# EAGLE design Mainboard (EAGLE 4.15)

## Sheet 1 of 2
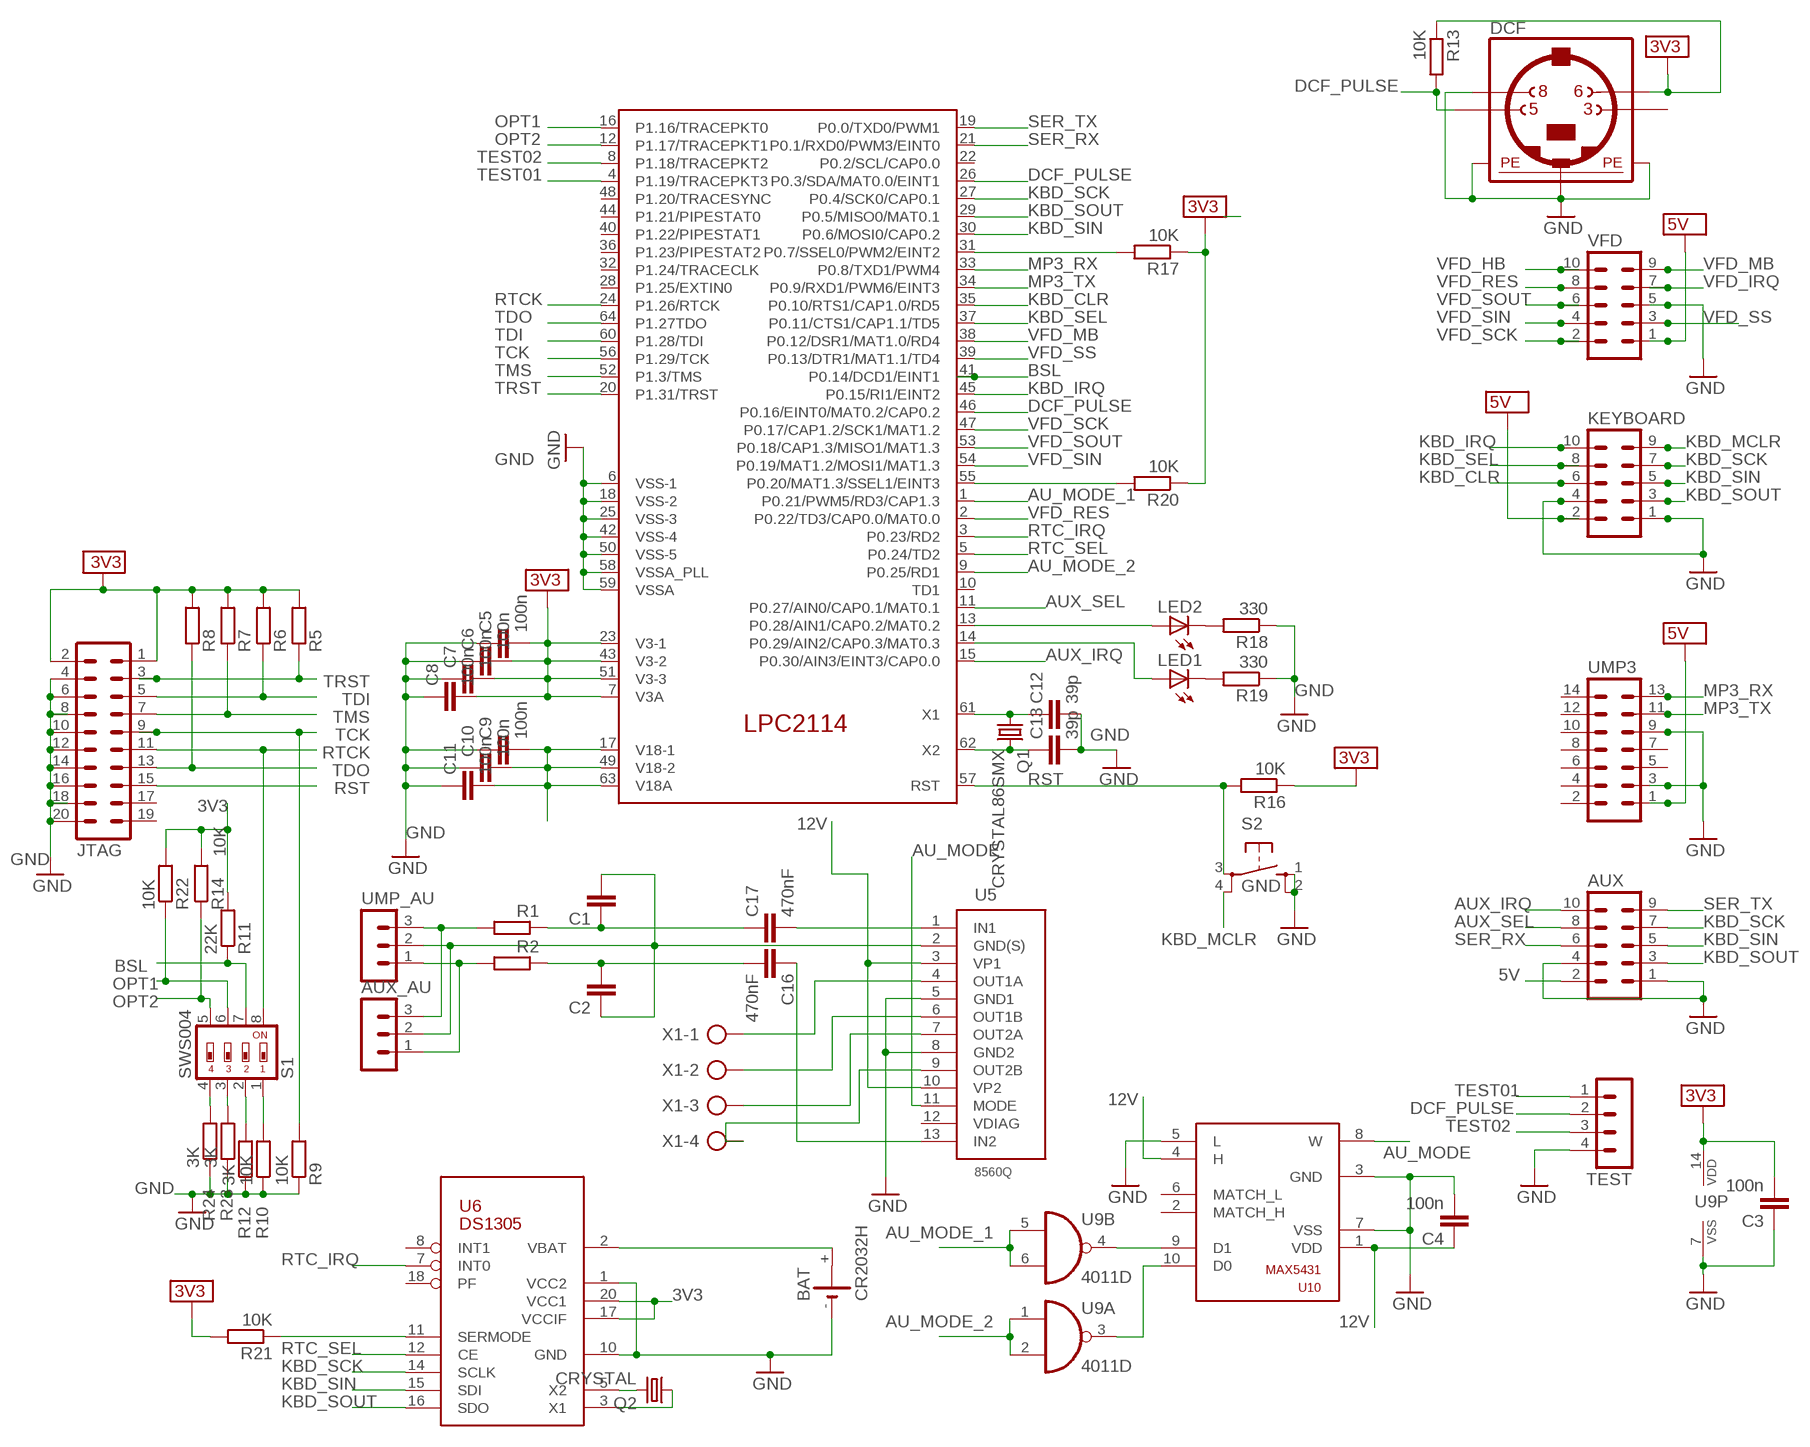
[diagram p0: schematic, sheet 1]

### Parts
AUX  ML10  [ML10]
AUX_AU  MA03-1  [MA03-1]
BAT  CR2032H  [CR2032H]
C1  C-EUC0805  [C0805]
C2  C-EUC0805  [C0805]
C3  100n  C-EUC0805  [C0805]
C4  100n  C-EUC0805  [C0805]
C5  100n  C-EUC0805  [C0805]
C6  100n  C-EUC0805  [C0805]
C7  100n  C-EUC0805  [C0805]
C8  100n  C-EUC0805  [C0805]
C9  100n  C-EUC0805  [C0805]
C10  100n  C-EUC0805  [C0805]
C11  100n  C-EUC0805  [C0805]
C12  39p  C-EUC0805  [C0805]
C13  39p  C-EUC0805  [C0805]
C16  470nF  C-EUC0805  [C0805]
C17  470nF  C-EUC0805  [C0805]
DCF  MINI_DIN_4  [M_DIN4]
JTAG  ML20L  [ML20L]
KEYBOARD  ML10  [ML10]
LED1  LEDCHIP-LED0805  [CHIP-LED0805]
LED2  LEDCHIP-LED0805  [CHIP-LED0805]
Q1  CRYSTAL86SMX  [86SMX]
Q2  CRYSTAL  CRYSTAL85SMX  [85SMX]
R1  R-EU_M0805  [M0805]
R2  R-EU_M0805  [M0805]
R5  R-EU_M0805  [M0805]
R6  R-EU_M0805  [M0805]
R7  R-EU_M0805  [M0805]
R8  R-EU_M0805  [M0805]
R9  10K  R-EU_M0805  [M0805]
R10  10K  R-EU_M0805  [M0805]
R11  22K  R-EU_M0805  [M0805]
R12  3K  R-EU_M0805  [M0805]
R13  10K  R-EU_M0805  [M0805]
R14  10K  R-EU_M0805  [M0805]
R16  10K  R-EU_M0805  [M0805]
R17  10K  R-EU_M0805  [M0805]
R18  330  R-EU_M0805  [M0805]
R19  330  R-EU_M0805  [M0805]
R20  10K  R-EU_M0805  [M0805]
R21  10K  R-EU_M0805  [M0805]
R22  10K  R-EU_M0805  [M0805]
R23  3K  R-EU_M0805  [M0805]
R24  3K  R-EU_M0805  [M0805]
S1  SWS004  [SMS-004]
S2  10XX  [B3F-10XX]
TEST  MA04-1  [MA04-1]
U1  LPC2114  [TQFP64-10X10]
U5  8560Q  [SOT141-6]
U6  DS1305  [TSSOP20]
U9  4011D  [SO14]
U10  MAX5431  [UMAX10]
UMP3  ML14  [ML14]
UMP_AU  MA03-1  [MA03-1]
VFD  ML10  [ML10]
X1  AK500/4  [AK500/4]

### Nets
1V8: C9.2 C10.2 C11.2 U1.17(V18-1) U1.49(V18-2) U1.63(V18A) ; also sheet 2
3V3: C3.2 C5.2 C6.2 C7.2 C8.2 DCF.6 JTAG.1 JTAG.2 R5.2 R6.2 R7.2 R8.2 R11.2 R13.1 R14.2 R16.1 R17.1 R20.1 R21.2 R22.2 U1.7(V3A) U1.23(V3-1) U1.43(V3-2) U1.51(V3-3) U6.17(VCCIF) U6.20(VCC1) U9.14(P:VDD) ; supply symbol labelled SUPPLY3V3 ; also sheet 2
5V [supply]: AUX.2 KEYBOARD.2 UMP3.1 VFD.1 ; supply symbol labelled SUPPLY5V ; also sheet 2
12V [highcurrent]: C4.1 U5.3(VP1) U5.10(VP2) U10.1(VDD) U10.4(H) ; also sheet 2
AU_MODE: U5.11(MODE) U10.8(W)
AU_MODE_1: U1.1(P0.21/PWM5/RD3/CAP1.3) U9.5(B:I0) U9.6(B:I1)
AU_MODE_2: U1.9(P0.25/RD1) U9.1(A:I0) U9.2(A:I1)
AUX_IRQ: AUX.10 U1.15(P0.30/AIN3/EINT3/CAP0.0)
AUX_SEL: AUX.8 U1.11(P0.27/AIN0/CAP0.1/MAT0.1)
BSL: R11.1 S1.7 U1.41(P0.14/DCD1/EINT1)
DCF_PULSE: DCF.5 R13.2 TEST.2 U1.26(P0.3/SDA/MAT0.0/EINT1) U1.46(P0.16/EINT0/MAT0.2/CAP0.2)
GND: AUX.1 AUX.4 BAT.- C3.1 C4.2 C5.1 C6.1 C7.1 C8.1 C9.1 C10.1 C11.1 C12.2 C13.2 DCF.8 DCF.SH1(PE1) DCF.SH2(PE2) DCF.SH3(PE3) JTAG.4 JTAG.6 JTAG.8 JTAG.10 JTAG.12 JTAG.14 JTAG.16 JTAG.18 JTAG.20 KEYBOARD.1 KEYBOARD.4 R9.1 R10.1 R12.1 R18.1 R19.1 R23.1 R24.1 S2.1 S2.2 TEST.4 U1.6(VSS-1) U1.18(VSS-2) U1.25(VSS-3) U1.42(VSS-4) U1.50(VSS-5) U1.58(VSSA_PLL) U1.59(VSSA) U5.5(GND1) U5.8(GND2) U6.1(VCC2) U6.10(GND) U9.7(P:VSS) U10.3(GND) U10.5(L) U10.7(VSS) UMP3.3 UMP3.9 VFD.5 ; also sheet 2
KBD_CLR: KEYBOARD.6 U1.35(P0.10/RTS1/CAP1.0/RD5)
KBD_IRQ: KEYBOARD.10 U1.45(P0.15/RI1/EINT2)
KBD_MCLR: KEYBOARD.9 S2.4
KBD_SCK: AUX.7 KEYBOARD.7 U1.27(P0.4/SCK0/CAP0.1) U6.14(SCLK)
KBD_SEL: KEYBOARD.8 U1.37(P0.11/CTS1/CAP1.1/TD5)
KBD_SIN: AUX.5 KEYBOARD.5 U1.30(P0.6/MOSI0/CAP0.2) U6.15(SDI)
KBD_SOUT: AUX.3 KEYBOARD.3 U1.29(P0.5/MISO0/MAT0.1) U6.16(SDO)
MP3_RX: U1.33(P0.8/TXD1/PWM4) UMP3.13
MP3_TX: U1.34(P0.9/RXD1/PWM6/EINT3) UMP3.11
N$1: AUX_AU.3 R1.2 UMP_AU.3
N$2: R10.2 S1.1
N$3: AUX_AU.1 R2.2 UMP_AU.1
N$4: LED1.C R19.2
N$5: R23.2 S1.3
N$6: LED2.C R18.2
N$7: LED2.A U1.13(P0.28/AIN1/CAP0.2/MAT0.2)
N$8: LED1.A U1.14(P0.29/AIN2/CAP0.3/MAT0.3)
N$9: R12.2 S1.2
N$10: C1.1 C17.1 R1.1
N$11: C2.2 C16.2 R2.1
N$12: AUX_AU.2 C1.2 C2.1 U5.2(GND(S)) UMP_AU.2
N$13: C17.2 U5.1(IN1)
N$14: C16.1 U5.13(IN2)
N$15 [highcurrent]: U5.4(OUT1A) X1.1
N$16 [highcurrent]: U5.6(OUT1B) X1.2
N$17 [highcurrent]: U5.7(OUT2A) X1.3
N$18 [highcurrent]: U5.9(OUT2B) X1.4
N$19: C12.1 Q1.1 U1.61(X1)
N$20: C13.1 Q1.4 U1.62(X2)
N$21: BAT.+ U6.2(VBAT)
N$22: Q2.4 U6.5(X2)
N$23: Q2.1 U6.3(X1)
N$24: U9.4(B:O) U10.9(D1)
N$25: U9.3(A:O) U10.10(D0)
N$26: R17.2 U1.31(P0.7/SSEL0/PWM2/EINT2)
N$27: R20.2 U1.55(P0.20/MAT1.3/SSEL1/EINT3)
N$28: R21.1 U6.11(SERMODE)
N$29: R24.2 S1.4
OPT1: R22.1 S1.6 U1.16(P1.16/TRACEPKT0)
OPT2: R14.1 S1.5 U1.12(P1.17/TRACEPKT1)
RST: JTAG.15 R16.2 S2.3 U1.57(RST)
RTC_IRQ: U1.3(P0.23/RD2) U6.7(INT0)
RTC_SEL: U1.5(P0.24/TD2) U6.12(CE)
RTCK: JTAG.11 S1.8 U1.24(P1.26/RTCK)
SER_RX: AUX.6 U1.21(P0.1/RXD0/PWM3/EINT0)
SER_TX: AUX.9 U1.19(P0.0/TXD0/PWM1)
TCK: JTAG.9 R9.2 U1.56(P1.29/TCK)
TDI: JTAG.5 R6.1 U1.60(P1.28/TDI)
TDO: JTAG.13 R8.1 U1.64(P1.27TDO)
TEST01: TEST.1 U1.4(P1.19/TRACEPKT3)
TEST02: TEST.3 U1.8(P1.18/TRACEPKT2)
TMS: JTAG.7 R7.1 U1.52(P1.3/TMS)
TRST: JTAG.3 R5.1 U1.20(P1.31/TRST)
VFD_HB: VFD.10
VFD_IRQ: VFD.7
VFD_MB: U1.38(P0.12/DSR1/MAT1.0/RD4) VFD.9
VFD_RES: U1.2(P0.22/TD3/CAP0.0/MAT0.0) VFD.8
VFD_SCK: U1.47(P0.17/CAP1.2/SCK1/MAT1.2) VFD.2
VFD_SIN: U1.54(P0.19/MAT1.2/MOSI1/MAT1.3) VFD.4
VFD_SOUT: U1.53(P0.18/CAP1.3/MISO1/MAT1.3) VFD.6
VFD_SS: U1.39(P0.13/DTR1/MAT1.1/TD4) VFD.3
Unconnected: BAT.+@1(+) DCF.3 JTAG.17 JTAG.19 U1.10(TD1) U1.22(P0.2/SCL/CAP0.0) U1.28(P1.25/EXTIN0) U1.32(P1.24/TRACECLK) U1.36(P1.23/PIPESTAT2) U1.40(P1.22/PIPESTAT1) U1.44(P1.21/PIPESTAT0) U1.48(P1.20/TRACESYNC) U5.12(VDIAG) U6.8(INT1) U6.18(PF) U9.8(C:I0) U9.9(C:I1) U9.10(C:O) U9.11(D:O) U9.12(D:I0) U9.13(D:I1) U10.2(MATCH_H) U10.6(MATCH_L) UMP3.2 UMP3.4 UMP3.5 UMP3.6 UMP3.7 UMP3.8 UMP3.10 UMP3.12 UMP3.14

## Sheet 2 of 2
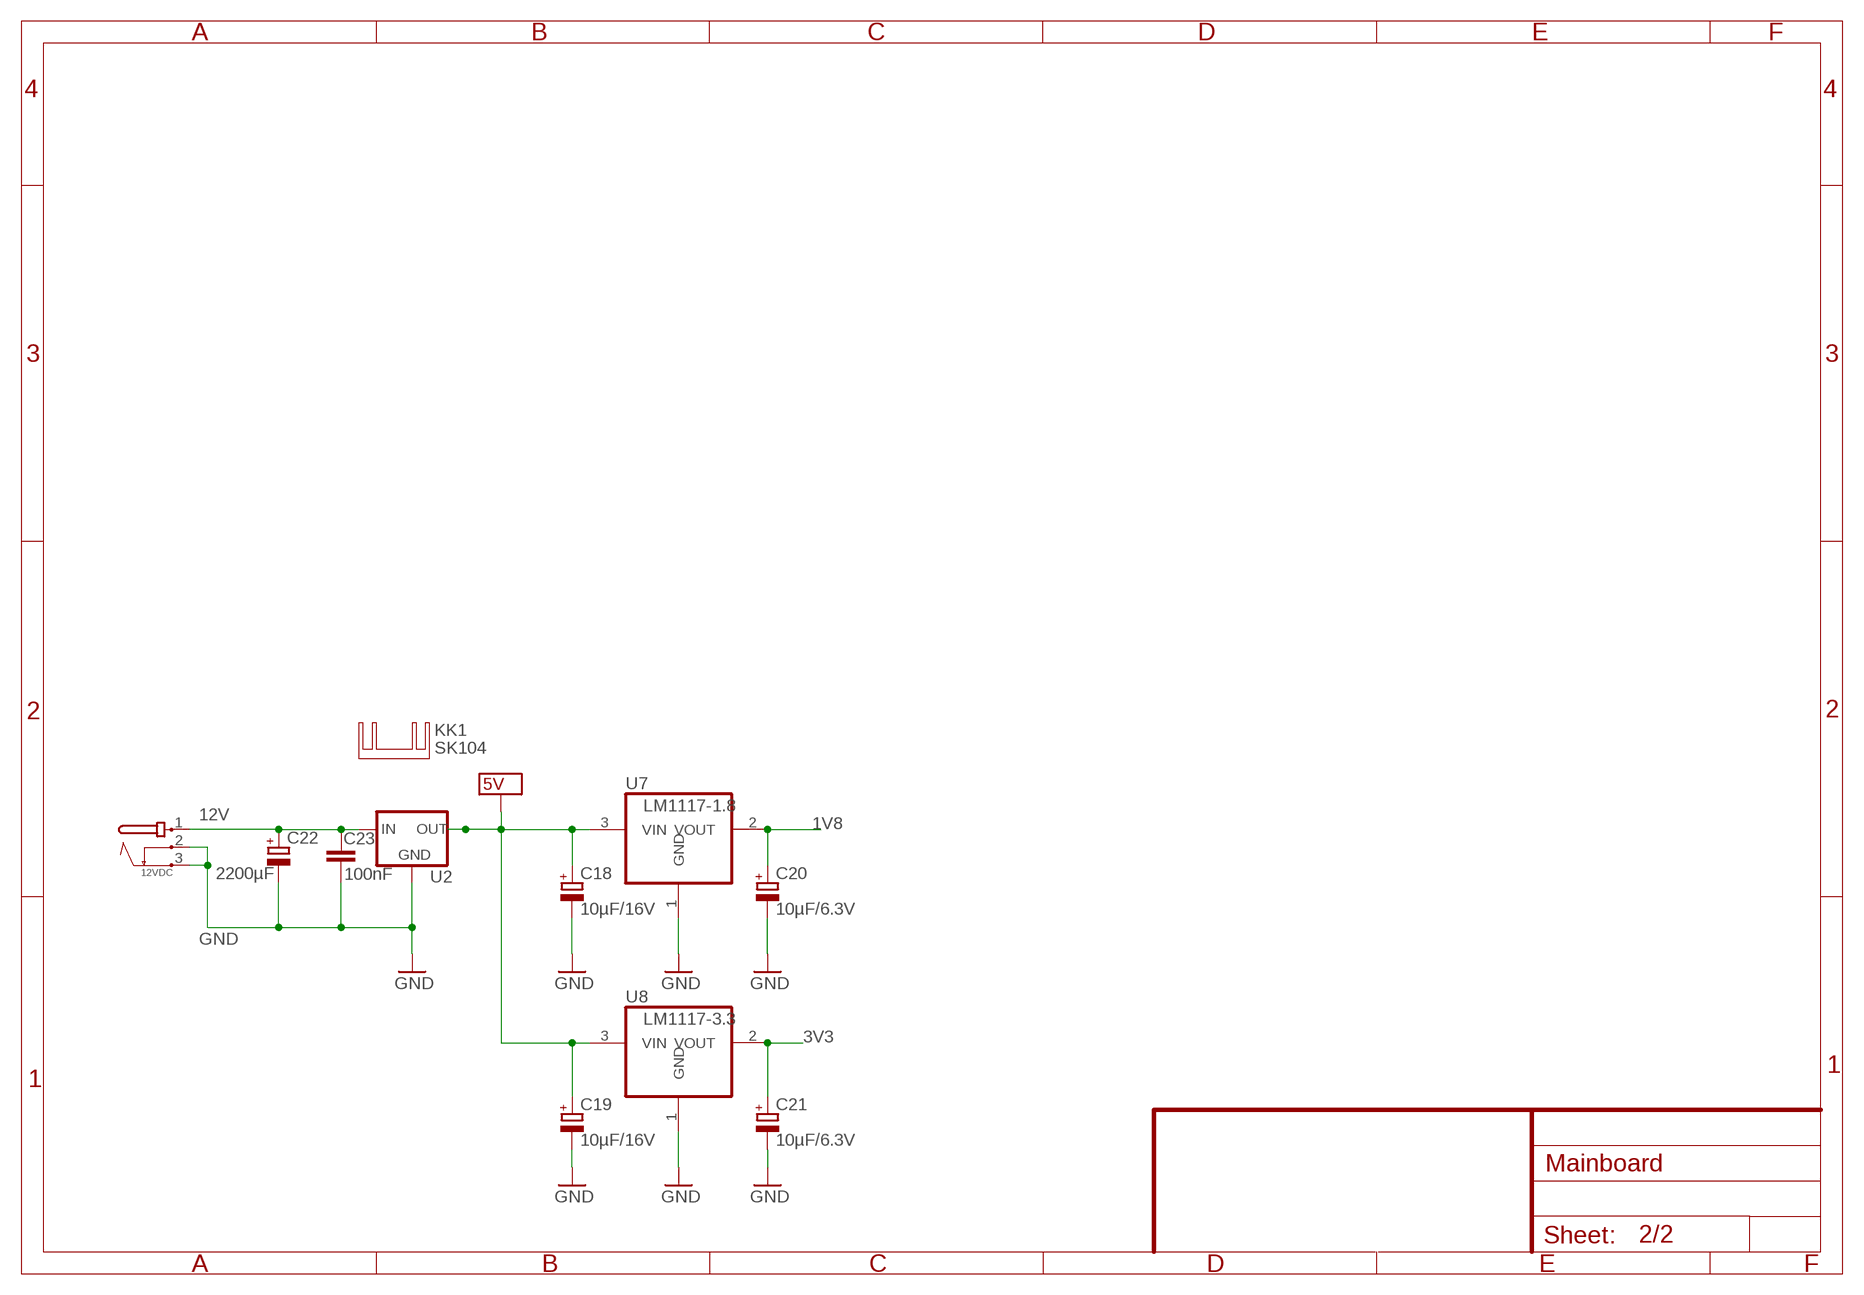
[diagram p1: schematic, sheet 2]

### Parts
12VDC  JACK-PMS  [JACK-PMS]
C18  10µF/16V  CPOL-EU153CLV-0405  [153CLV-0405]
C19  10µF/16V  CPOL-EU153CLV-0405  [153CLV-0405]
C20  10µF/6.3V  CPOL-EU153CLV-0405  [153CLV-0405]
C21  10µF/6.3V  CPOL-EU153CLV-0405  [153CLV-0405]
C22  2200µF  C-BIG  [PANASONIC_G]
C23  100nF  C-EUC0805K  [C0805K]
KK1  SK104  [SK104]
U2  78XXS  [78XXS]
U7  LM1117-1.8  REG1117  [SOT223]
U8  LM1117-3.3  REG1117  [SOT223]

### Nets
1V8: C20.+ U7.2(VOUT) ; also sheet 1
3V3: C21.+ U8.2(VOUT) ; also sheet 1
5V [supply]: C18.+ C19.+ U2.OUT U7.3(VIN) U8.3(VIN) ; supply symbol labelled SUPPLY5V ; also sheet 1
12V [highcurrent]: 12VDC.1 C22.+ C23.2 U2.IN ; also sheet 1
GND: 12VDC.2 12VDC.3 C18.- C19.- C20.- C21.- C22.- C23.1 U2.GND U7.1(GND) U8.1(GND) ; also sheet 1

## Library data of the parts
12VDC = POWER-IN:JACK-PMS
AUX KEYBOARD VFD = con-harting-ml:ML10: HARTING
AUX_AU UMP_AU = con-lstb:MA03-1: PIN HEADER
BAT = battery:CR2032H: LI BATTERY Varta
C1-C13 C16 C17 C23 = rcl:C-EU: CAPACITOR, European symbol
C18-C21 = rcl:CPOL-EU: POLARIZED CAPACITOR, European symbol
C22 = turbod3:C-BIG
DCF = mini_din:MINI_DIN_4
JTAG = con-harting-ml:ML20: HARTING
KK1 = heatsink:SK104: HEATSINK manufacturer Fischer/distributor Buerklin
LED1 LED2 = led:LED: LED OSRAM: - CHIPLED LG R971, LG N971, LY N971, LG Q971, LY Q971, LO R971, LY R971 LH N974, LH R974 LS Q976, LO Q976, LY Q976 LO Q996 - Hyper CHIPLED LW Q18S LB Q993, LB Q99A, LB R99A - SideLED LS A670, LO A670, LY A670, LG A670, LP A670 LB A673, LV A673, LT A673, LW A673 LH A674 LY A675 LS A676, LA A676, LO A676, LY A676, LW A676 LS A679, LY A679, LG A679 - Hyper Micro SIDELED® LS Y876, LA Y876, LO Y876, LY Y876 LT Y87S - SmartLED LW L88C, LW L88S LB L89C, LB L89S, LG L890 LS L89K, LO L89K, LY L89K LS L896, LA L896, LO L896, LY L896 - TOPLED LS T670, LO T670, LY T670, LG T670, LP T670 LSG T670, LSP T670, LSY T670, LOP T670, LYG T670 LG T671, LOG T671, LSG T671 LB T673, LV T673, LT T673, LW T673 LH T674 LS T676, LA T676, LO T676, LY T676, LB T676, LH T676, LSB T676, LW T676 LB T67C, LV T67C, LT T67C, LS T67K, LO T67K, LY T67K, LW E67C LS E67B, LA E67B, LO E67B, LY E67B, LB E67C, LV E67C, LT E67C LW T67C LS T679, LY T679, LG T679 LS T770, LO T770, LY T770, LG T770, LP T770 LB T773, LV T773, LT T773, LW T773 LH T774 LS E675, LA E675, LY E675, LS T675 LS T776, LA T776, LO T776, LY T776, LB T776 LHGB T686 LT T68C, LB T68C - Hyper Mini TOPLED® LB M676 - Mini TOPLED Santana® LG M470 LS M47K, LO M47K, LY M47K Source: http://www.osram.convergy.de/
Q1 Q2 = turbod3:CRYSTAL
R1 R2 R5-R14 R16-R24 = rcl:R-EU_: RESISTOR, European symbol
S1 = smd-special:SWS004: SMD Dip Switch 4 pol.
S2 = KEY_B:10XX
TEST = con-lstb:MA04-1: PIN HEADER
U1 = philips-2:LPC2114
U2 = v-reg:78XXS: VOLTAGE REGULATOR
U5 = tda8560q:8560Q: 2x40W Stereo BTL Amplifier
U6 = turbod3:DS1305
U7 U8 = burr-brown:REG1117: 800mA and 1A Low Dropout (LDO) Positive Regulator 1.8V, 2.5V, 2.85V, 3.3V, 5V, and Adj
U9 = 40xx:4011: Quad 2-input NAND
U10 = turbod3:MAX5431
UMP3 = con-harting-ml:ML14: HARTING
X1 = con-ptr500:AK500/4: CONNECTOR

## Net classes
1 supply: width 0.7 mm
2 highcurrent: width 2 mm

## Board
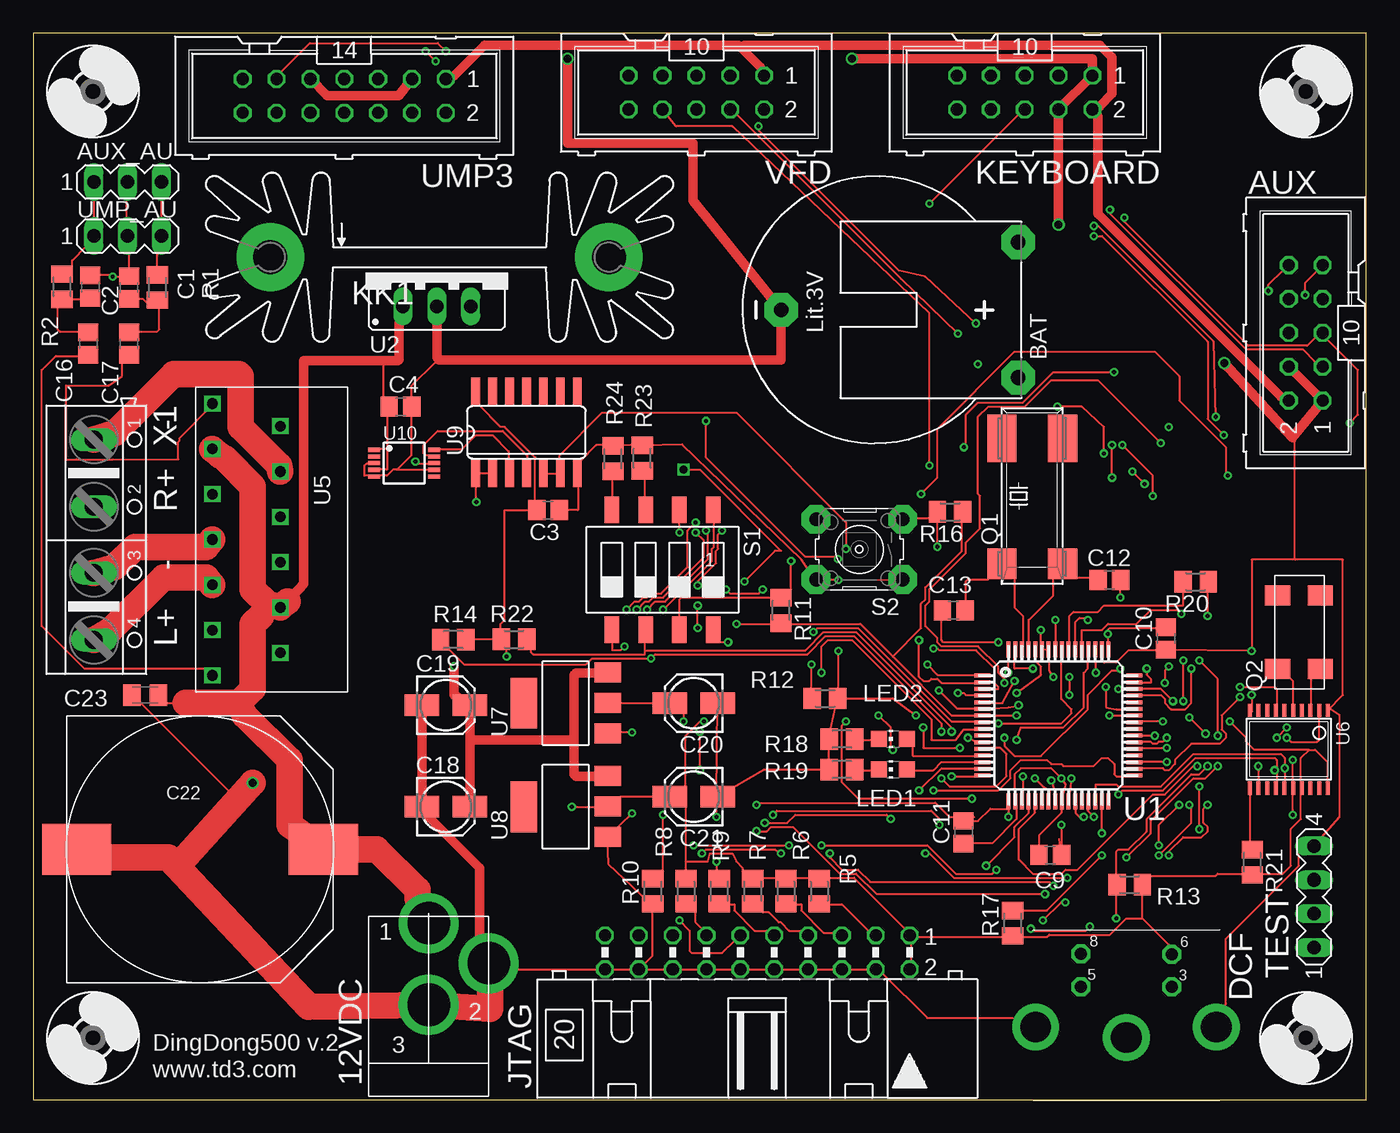
[diagram p2: board, top side]
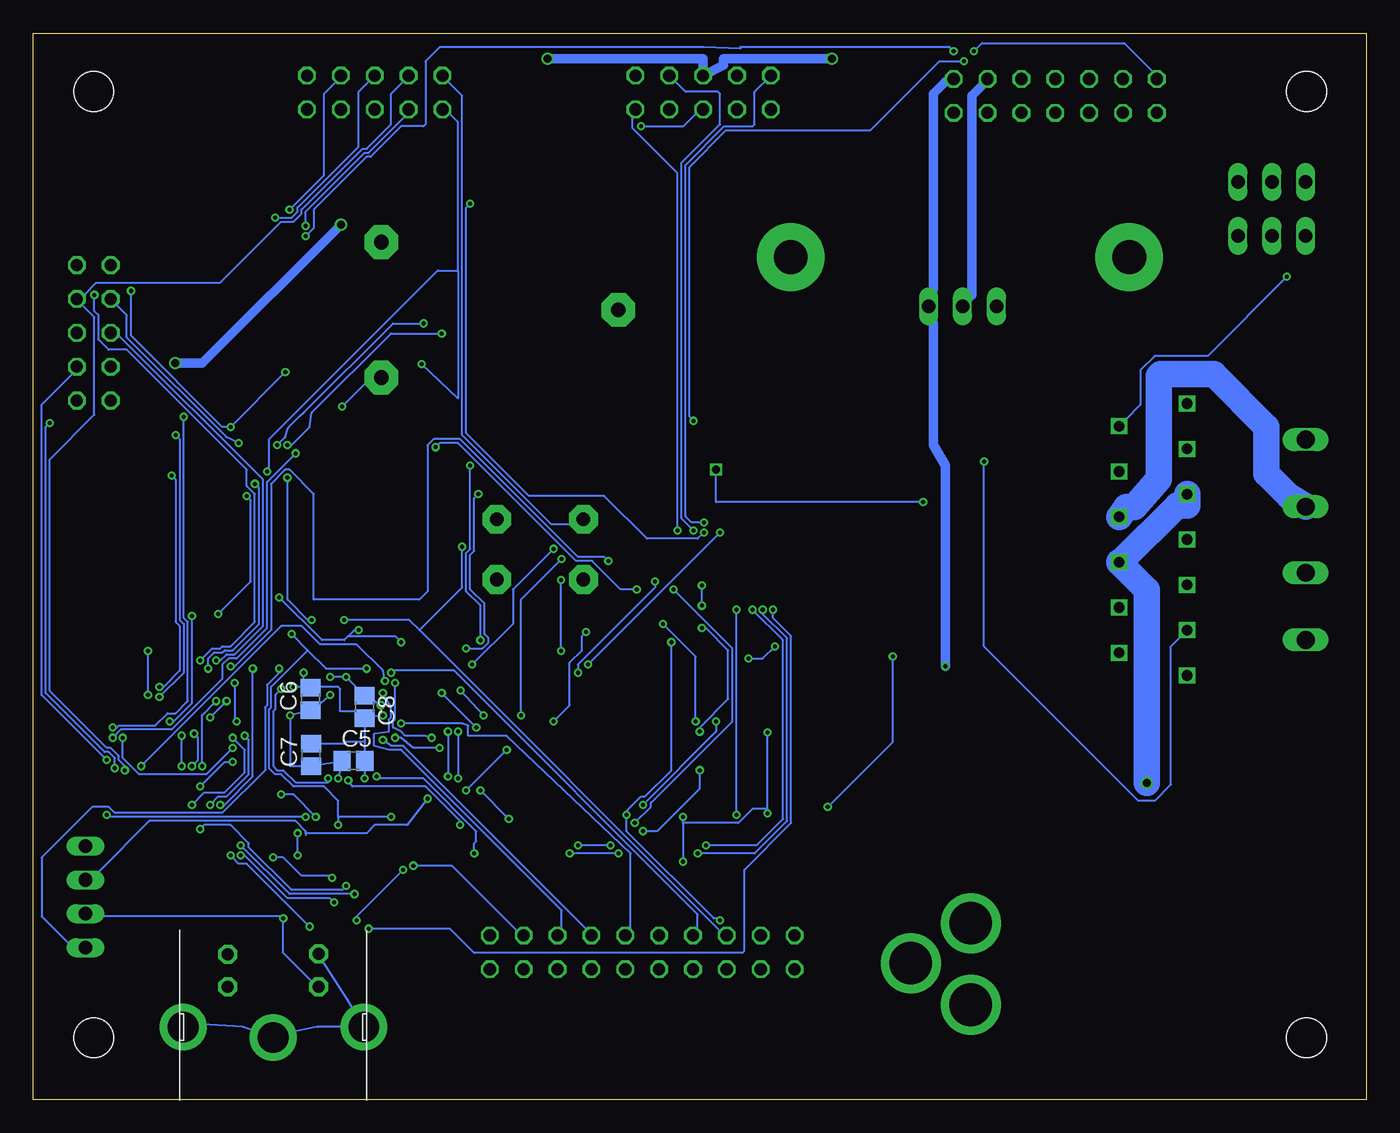
[diagram p3: board, bottom side, seen from below]

Size 100 x 80 mm. Coordinates in mm from the lower left corner, seen from the top.
Outline: 0,0 100,0 100,80 0,80 0,0
Copper layers (1*16): Top 0.035mm / dielectric 1.5mm / Bottom 0.035mm
Design rules "PCB-POOL": minimum track width 6mil, minimum drill 12mil, track to track 6mil, track to pad 6mil, pad to pad 6mil, via to via 6mil, smd to smd 6mil, copper to edge 20mil, drill to drill 8mil, minimum pad ring 8mil, minimum via ring 6mil, stop-mask expansion 3mil, vias tented up to drill 0mil, thermal gap 8mil

### Footprints (pad centres in the part's own frame; a part is rotated, then mirrored left to right if it is on the bottom)
JACK-PMS = drill 3.2 pad 4.5 round: 1 -0.5,-3.31; 2 -5,-0.31; 3 -0.5,2.809
ML10 = drill 0.914 octagon: 1 -5.08,-1.27; 2 -5.08,1.27; 3 -2.54,-1.27; 4 -2.54,1.27; 5 0,-1.27; 6 0,1.27; 7 2.54,-1.27; 8 2.54,1.27; 9 5.08,-1.27; 10 5.08,1.27
MA03-1 = drill 1.016 long: 1 -2.54,0; 2 0,0; 3 2.54,0
CR2032H = drill 1.118 pad 2.54 octagon: + 5.08,10.795; +@1 -5.08,10.795; - 0,-6.985
C0805 = smd 1.3 x 1.5: 1 -0.85,0; 2 0.85,0
153CLV-0405 = smd 2.6 x 1.6: + 1.8,0; - -1.8,0
PANASONIC_G = smd 5.2 x 3.8: + 9.25,0; - -9.25,0
C0805K = smd 1.3 x 1.6: 1 -1,0; 2 1,0
M_DIN4 = drill 0.9 pad 1.422 octagon: 3 -3.4,-3.75; 5 3.4,-3.75; 6 -3.4,-6.2; 8 3.4,-6.25 | drill 2.3 pad 3.5 round: SH1 6.8,-0.75; SH2 0,0.05; SH3 -6.75,-0.75
ML20L = drill 0.914 octagon: 1 -11.43,-1.27; 2 -11.43,1.27; 3 -8.89,-1.27; 4 -8.89,1.27; 5 -6.35,-1.27; 6 -6.35,1.27; 7 -3.81,-1.27; 8 -3.81,1.27; 9 -1.27,-1.27; 10 -1.27,1.27; 11 1.27,-1.27; 12 1.27,1.27; 13 3.81,-1.27; 14 3.81,1.27; 15 6.35,-1.27; 16 6.35,1.27; 17 8.89,-1.27; 18 8.89,1.27; 19 11.43,-1.27; 20 11.43,1.27
SK104 = drill 2.54 pad 5.08 round: A2,5 -12.7,-0.762; B2,5 12.7,-0.762
CHIP-LED0805 = smd 1.2 x 1.2: A 0,-1.05; C 0,1.05
86SMX = smd 2.286 x 2.184: 1 -5.08,-2.286; 4 -5.08,2.286 | smd 3.556 x 2.184: 2 4.318,-2.286; 3 4.318,2.286
85SMX = smd 1.5 x 1.9: 1 -2.6,-1.6; 2 2.9,-1.6; 3 2.9,1.6; 4 -2.6,1.6
M0805 = smd 1.3 x 1.6: 1 -0.95,0; 2 0.95,0
SMS-004 = smd 1.092 x 2.007: 1 -3.81,-4.496; 2 -1.27,-4.496; 3 1.27,-4.496; 4 3.81,-4.496; 5 3.81,4.496; 6 1.27,4.496; 7 -1.27,4.496; 8 -3.81,4.496
B3F-10XX = drill 1.016 pad 2.159 octagon: 1 -3.379,2.312; 2 3.123,2.312; 3 -3.379,-2.209; 4 3.123,-2.209
MA04-1 = drill 1.016 long: 1 -3.81,0; 2 -1.27,0; 3 1.27,0; 4 3.81,0
TQFP64-10X10 = smd 1.2 x 0.3: 1 -5.7,3.75; 2 -5.7,3.25; 3 -5.7,2.75; 4 -5.7,2.25; 5 -5.7,1.75; 6 -5.7,1.25; 7 -5.7,0.75; 8 -5.7,0.25; 9 -5.7,-0.25; 10 -5.7,-0.75; 11 -5.7,-1.25; 12 -5.7,-1.75; 13 -5.7,-2.25; 14 -5.7,-2.75; 15 -5.7,-3.25; 16 -5.7,-3.75; 33 5.7,-3.75; 34 5.7,-3.25; 35 5.7,-2.75; 36 5.7,-2.25; 37 5.7,-1.75; 38 5.7,-1.25; 39 5.7,-0.75; 40 5.7,-0.25; 41 5.7,0.25; 42 5.7,0.75; 43 5.7,1.25; 44 5.7,1.75; 45 5.7,2.25; 46 5.7,2.75; 47 5.7,3.25; 48 5.7,3.75 | smd 0.3 x 1.2: 17 -3.75,-5.7; 18 -3.25,-5.7; 19 -2.75,-5.7; 20 -2.25,-5.7; 21 -1.75,-5.7; 22 -1.25,-5.7; 23 -0.75,-5.7; 24 -0.25,-5.7; 25 0.25,-5.7; 26 0.75,-5.7; 27 1.25,-5.7; 28 1.75,-5.7; 29 2.25,-5.7; 30 2.75,-5.7; 31 3.25,-5.7; 32 3.75,-5.7; 49 3.75,5.7; 50 3.25,5.7; 51 2.75,5.7; 52 2.25,5.7; 53 1.75,5.7; 54 1.25,5.7; 55 0.75,5.7; 56 0.25,5.7; 57 -0.25,5.7; 58 -0.75,5.7; 59 -1.25,5.7; 60 -1.75,5.7; 61 -2.25,5.7; 62 -2.75,5.7; 63 -3.25,5.7; 64 -3.75,5.7
78XXS = drill 1.016 long: GND 0,-2.54; IN -2.54,-2.54; OUT 2.54,-2.54
SOT141-6 = drill 0.8 square: 1 -10.2,-3.81; 2 -8.5,1.29; 3 -6.8,-3.81; 4 -5.1,1.29; 5 -3.4,-3.81; 6 -1.7,1.29; 7 0,-3.81; 8 1.7,1.29; 9 3.4,-3.81; 10 5.1,1.29; 11 6.8,-3.81; 12 8.5,1.29; 13 10.2,-3.81
TSSOP20 = smd 0.305 x 0.991: 1 -2.925,-2.918; 2 -2.275,-2.918; 3 -1.625,-2.918; 4 -0.975,-2.918; 5 -0.325,-2.918; 6 0.325,-2.918; 7 0.975,-2.918; 8 1.625,-2.918; 9 2.275,-2.918; 10 2.925,-2.918; 11 2.925,2.918; 12 2.275,2.918; 13 1.625,2.918; 14 0.975,2.918; 15 0.325,2.918; 16 -0.325,2.918; 17 -0.975,2.918; 18 -1.625,2.918; 19 -2.275,2.918; 20 -2.925,2.918
SOT223 = smd 1.499 x 2.007: 1 -2.261,-3.15; 2 0.025,-3.15; 3 2.311,-3.15 | smd 3.81 x 2.007: 4 0,3.15
SO14 = smd 0.66 x 2.032: 1 -3.81,-3.073; 2 -2.54,-3.073; 3 -1.27,-3.073; 4 0,-3.073; 5 1.27,-3.073; 6 2.54,-3.073; 7 3.81,-3.073; 8 3.81,3.073; 9 2.54,3.073; 10 1.27,3.073; 11 0,3.073; 12 -1.27,3.073; 13 -2.54,3.073; 14 -3.81,3.073
UMAX10 = smd 0.32 x 0.9: 1 -1,-2.25; 2 -0.5,-2.25; 3 0,-2.25; 4 0.5,-2.25; 5 1,-2.25; 6 1,2.25; 7 0.5,2.25; 8 0,2.25; 9 -0.5,2.25; 10 -1,2.25
3,0 = hole 3: 0,0
ML14 = drill 0.914 octagon: 1 -7.62,-1.27; 2 -7.62,1.27; 3 -5.08,-1.27; 4 -5.08,1.27; 5 -2.54,-1.27; 6 -2.54,1.27; 7 0,-1.27; 8 0,1.27; 9 2.54,-1.27; 10 2.54,1.27; 11 5.08,-1.27; 12 5.08,1.27; 13 7.62,-1.27; 14 7.62,1.27
AK500/4 = drill 1.321 long: 1 -7.518,0; 2 -2.489,0; 3 2.489,0; 4 7.518,0

### Placement (x,y rotation side)
12VDC  29.17,9.92 180 top
AUX  95.47,57.53 90 top
AUX_AU  7.07,68.85 0 top
BAT  63.1,59.25 270 top
C1  7.18,60.93 90 top
C2  4.28,60.98 270 top
C3  38.62,44.22 180 top
C4  27.55,51.99 0 top
C5  75.98,25.42 0 bottom
C6  79.19,30.05 90 bottom
C7  79.16,25.85 90 bottom
C8  75.15,29.46 270 bottom
C9  76.29,18.35 0 top
C10  84.98,34.59 90 top
C11  69.79,20.06 90 top
C12  80.73,38.98 0 top
C13  69.05,36.7 180 top
C16  4.13,56.71 90 top
C17  7.18,56.71 270 top
C18  30.95,21.97 0 top
C19  30.95,29.59 0 top
C20  49.54,29.74 180 top
C21  49.54,22.73 180 top
C22  12.51,18.77 0 top
C23  8.39,30.35 0 top
DCF  82,4.69 180 top
JTAG  54.32,11.04 180 top
KEYBOARD  74.38,75.56 180 top
KK1  30.48,63.97 0 top
LED1  64.48,24.76 90 top
LED2  64.48,27.05 90 top
Q1  74.94,45.28 90 top
Q2  94.96,34.92 90 top
R1  9.31,60.93 90 top
R2  2.15,60.98 90 top
R5  58.97,15.63 90 top
R6  56.47,15.63 90 top
R7  53.97,15.63 90 top
R8  48.97,15.63 90 top
R9  51.47,15.63 270 top
R10  46.47,15.63 90 top
R11  56.1,36.7 270 top
R12  59.4,30.09 180 top
R13  82.26,16.12 180 top
R14  31.51,34.51 0 top
R16  68.78,44.09 180 top
R17  73.47,13.23 90 top
R18  60.67,27.05 0 top
R19  60.67,24.76 0 top
R20  87.2,38.84 180 top
R21  91.46,17.81 270 top
R22  36.07,34.53 180 top
R23  45.68,48.13 270 top
R24  43.49,48.09 270 top
S1  47.21,39.75 180 top
S2  61.85,41.33 180 top
TEST  96.09,15.21 90 top
U1  76.92,28.06 0 top
U2  30.28,62.05 0 top
U5  17.25,42.02 270 top
U6  94.2,26.28 180 top
U7  39.94,29.74 90 top
U8  39.94,21.97 90 top
U9  37,50.06 0 top
U10  27.82,47.75 270 top
U$2  [3,0]  4.47,75.63 0 top
U$4  [3,0]  95.47,75.63 0 top
U$7  [3,0]  95.47,4.63 0 top
U$13  [3,0]  4.47,4.63 0 top
UMP3  23.33,75.31 180 top
UMP_AU  7.07,64.79 0 top
VFD  49.75,75.56 180 top
X1  4.53,42 270 top

### Tracks (layer width: path | path; a pad name or v marks a point on that pad's centre or on a via)
1V8  (via drill 0.3)
  Top 0.152: v74.99,32.33 73.62,32.33 73.62,33.24 U1.63 | U1.49 80.63,34.31 v80.63,34.92 80.48,35.07 80.78,35.38 84.29,35.38 C10.2 | U7.2 44.06,29.74 C20.+ 48.78,28.98 v48.78,28.37 | 76.97,19.53 C9.2 77.13,19.07 v77.13,20.59 | v54.27,22.12 54.42,22.27 67.68,22.27 68.75,21.2 70.57,21.2 C11.2 70.42,20.9 70.88,20.9 71.79,21.81 73.16,21.81 | 73.16,21.81 v73.16,21.2 | 73.16,21.81 U1.17
  Bottom 0.152: v74.99,32.33 78.04,32.33 79.41,33.7 | 79.41,33.7 v80.63,34.92 | v48.78,28.37 48.78,27.61 v54.27,22.12 | 79.41,33.7 82.16,30.96 82.16,29.43 82.31,29.28 82.31,24.86 81.85,24.4 81.39,24.4 80.48,23.49 78.19,23.49 77.13,22.42 77.13,21.2 | 77.13,21.2 v77.13,20.59 | v73.16,21.2 77.13,21.2
3V3  (via drill 0.3)
  Top 0.152: v75.15,24.1 75.76,23.49 76.21,23.18 76.21,22.88 U1.23 | v80.48,30.96 80.48,29.43 81.24,29.28 82.16,29.28 U1.43 | v79.72,32.02 79.72,33.24 U1.51 | v73.77,28.82 71.79,28.82 U1.7 70.73,28.82 68.9,28.82 64.48,33.24 | 64.48,33.24 62.04,35.68 56.86,35.68 R11.2 55.33,35.68 v52.74,35.68 | 64.48,33.24 66.61,35.38 66.61,37.21 66.92,37.51 66.92,38.43 69.66,41.17 69.66,43.3 R16.1 | 83.22,13.58 83.22,15.41 R13.1 83.83,16.78 88.71,16.78 88.86,16.94 90.69,16.94 R21.2 92.22,16.94 93.74,16.94 94.35,17.55 94.35,20.29 95.11,21.05 95.11,22.88 U6.17 95.11,23.79 95.11,25.62 95.72,26.23 | 83.22,13.58 85.2,11.6 DCF.6 | 95.72,26.23 96.18,26.23 97.09,25.32 97.09,23.79 U6.20 | v88.1,36.29 88.1,38.12 R20.1 | v89.78,28.37 91,27.15 91,26.84 91.61,26.23 95.72,26.23 | JTAG.1 66.31,12.21 72.71,12.21 R17.1 74.23,12.21 76.06,12.21 76.21,12.37 80.78,12.37 82,13.58 83.22,13.58 | JTAG.2 65.85,10.38 65.85,11.76 JTAG.1 | JTAG.1 65.39,12.82 61.58,16.63 59.75,16.63 R5.2 58.23,16.63 57.16,16.63 R6.2 55.79,16.63 54.72,16.63 R7.2 53.2,17.09 53.2,17.39 52.74,17.85 52.44,18.46 50.76,18.46 50.61,17.85 48.93,17.85 | R22.2 34.81,34.53 32.98,34.53 R14.2 32.47,33.85 | C21.+ 44.06,22.73 U8.2 42.23,21.97 v40.4,21.97 | 48.93,17.85 48.93,21.97 C21.+ | 48.93,17.85 48.93,17.09 R8.2 | v35.52,33.24 35.52,35.07 R22.2 | v50.3,28.37 50,28.37 48.93,27.3 48.93,23.49 C21.+ | 37.66,44.22 35.37,44.22 35.37,35.99 35.06,35.68 35.06,35.23 R22.2 | U9.14 33.39,52.14 35.06,50.47 35.37,50.47 37.66,48.18 37.66,44.22 | 37.66,44.22 C3.2
  Bottom 0.152: 75.15,26.84 76.52,26.84 76.67,26.69 78.5,26.69 C7.2 | 75.15,26.84 75.15,26.08 C5.2 75.15,24.71 v75.15,24.1 | v80.48,30.96 79.87,30.96 C6.2 | v79.72,32.02 79.72,31.41 C6.2 | C6.2 78.5,30.96 77.13,30.96 76.97,30.8 76.97,29.13 75.91,29.13 C8.2 | C8.2 75.15,26.84 | v88.1,36.29 88.1,29.74 89.47,28.37 v89.78,28.37 | v35.52,33.24 35.52,26.84 v40.4,21.97 | v52.74,35.68 50.3,33.24 v50.3,28.37 | C8.2 74.99,28.67 v73.77,28.82
5V  (via drill 0.3)
  Top 0.7: AUX.2 93.59,52.75 79.87,66.47 79.87,73.78 KEYBOARD.2 80.02,74.54 80.94,75.46 80.94,78.2 80.02,79.12 53.35,79.12 53.12,78.89 | 40.55,26.99 40.55,31.87 40.7,32.02 42.23,32.02 U7.3 | 40.55,26.99 40.55,24.4 40.7,24.25 42.23,24.25 U8.3 | 32.78,26.99 32.78,28.82 C19.+ 31.56,30.35 v31.56,32.51 | 32.78,26.99 32.78,22.73 C18.+ | 32.78,26.99 40.55,26.99 | 53.12,78.89 54.57,77.44 VFD.1 | 53.12,78.89 52.9,79.12 33.85,79.12 31.56,76.83 UMP3.1
  Bottom 0.7: UMP3.1 31.56,76.37 32.47,75.46 32.47,60.83 U2.OUT 32.47,58.24 32.47,49.09 31.55,47.57 31.55,42.7 31.56,42.69 v31.56,32.51
12V
  Top 0.152: 9.4,30.4 9.37,30.43 | C23.2 9.4,30.4 | 11.44,29.74 10.06,29.74 9.4,30.4 | 26.23,55.43 26.23,52.6 C4.1 26.53,51.99 26.53,48.79 | U10.4 26.53,47.25 26.53,48.79 | U10.1 25.62,48.75 25.62,48.79 26.53,48.79
  Top 0.7: 19.06,37.36 20.27,38.67 20.27,55.43 26.23,55.43 27.37,55.43 27.37,55.53 27.45,55.53 27.45,58.24 U2.IN
  Top 2: 12VDC.1 28.82,15.11 28.82,15.72 25.77,18.77 C22.+ 19.21,20.59 19.21,25.47 15.86,28.82 15.41,29.74 | 19.06,37.36 U5.10 17.54,37.21 | 17.54,37.21 16.47,38.27 16.47,45.99 14.39,48.08 14.03,48.33 U5.3 | 11.44,29.74 15.41,29.74 | 15.41,29.74 16.47,30.8 16.47,35.68 17.08,36.29 17.54,37.21
AU_MODE  (via drill 0.3)
  Top 0.152: v28.66,47.87 28.82,47.72 29.73,47.72 U10.8
  Bottom 0.152: v28.66,47.87 28.66,34.01 17.08,22.42 15.86,22.42 14.64,23.64 14.64,34.01 14.03,34.62 U5.11
AU_MODE_1  (via drill 0.3)
  Top 0.152: v67.07,32.63 67.83,31.87 70.73,31.87 U1.1 | v60.97,41.32 60.97,43.3 52.74,51.53 42.69,51.53 39.48,48.33 39.48,47.87 U9.6 39.33,46.96 38.57,46.96 U9.5
  Bottom 0.152: v67.07,32.63 64.02,35.68 64.02,38.27 v60.97,41.32
AU_MODE_2  (via drill 0.3, 0.6)
  Top 0.152: U9.1 33.39,46.96 34.15,46.96 U9.2 33.24,46.99 v33.24,44.83 | v48.78,47.26 50,47.26 56.1,41.17 55.64,41.17 v53.35,38.88 | v59.14,32.02 59.14,34.01 59.6,34.46 61.43,34.46 67.37,28.52 67.37,26.99 69.2,26.99 69.81,27.76 71.18,27.76 U1.9
  Bottom 0.152: v33.24,44.83 48.78,44.83 v48.78,47.26 | v53.35,38.88 53.35,38.43 59.14,32.63 v59.14,32.02
AUX_IRQ  (via drill 0.3)
  Top 0.152: v66.46,23.18 68.14,24.86 70.73,24.86 U1.15 | v64.33,21.05 64.02,21.36 57.16,21.36 56.55,20.75 v54.88,20.75 | v51.98,38.27 52.29,37.97 54.42,37.97 v54.72,38.27 | v92.67,60.68 92.67,61.13 93.74,62.2 AUX.10 | v81.09,54.58 76.52,54.58 74.23,52.29 70.88,52.29 69.96,51.38 69.96,49.09 v69.81,48.94
  Bottom 0.152: v64.33,21.05 v66.46,23.18 | v54.88,20.75 53.66,21.97 53.66,22.27 47.56,28.37 47.56,33.85 v51.98,38.27 | v54.72,38.27 55.94,38.27 58.08,40.41 59.3,40.41 68.14,49.25 69.51,49.25 v69.81,48.94 | v92.67,60.68 92.67,57.32 85.81,50.47 v85.2,50.47 v81.09,54.58
AUX_SEL  (via drill 0.3)
  Top 0.152: v70.12,27.15 70.73,26.84 U1.11 | v72.86,31.26 72.86,31.57 72.4,32.02 72.4,32.48 70.88,34.01 68.14,34.01 67.83,34.31 67.83,34.62 66.92,35.53 66.92,37.05 67.22,37.36 67.22,38.27 69.96,41.02 69.96,41.78 71.03,42.85 71.03,45.28 70.88,45.44 70.88,51.23 71.64,51.99 74.38,51.99 76.36,53.97 79.87,53.97 v84.59,49.25
  Bottom 0.152: v70.12,27.15 70.57,27.3 72.1,27.3 72.4,27.61 73.01,27.91 73.01,28.37 72.86,28.52 v72.86,31.26 | v84.59,49.25 85.51,49.7 92.98,57.17 92.98,58.85 AUX.8
BSL  (via drill 0.3)
  Top 0.152: S1.7 48.48,37.51 48.63,37.66 55.33,37.66 R11.1 56.86,38.27 v56.86,40.41 | v84.75,28.37 83.22,28.37 U1.41 | v84.9,31.26 84.9,32.18 v85.2,32.48
  Bottom 0.152: v84.75,28.37 84.9,28.52 v84.9,31.26 | v85.2,32.48 84.9,32.48 82.16,35.23 82.16,46.2 81.09,47.26 80.78,47.26 78.96,45.44 78.96,37.51 71.03,37.51 70.42,38.12 70.42,49.09 69.96,49.55 67.98,49.55 59.14,40.71 57.16,40.71 v56.86,40.41
DCF_PULSE  (via drill 0.3)
  Top 0.152: v77.89,24.1 77.74,22.88 U1.26 | v81.39,30.8 82.16,30.8 U1.46 83.22,30.8 84.59,30.8 v85.51,29.89 | v81.24,13.58 81.24,15.41 R13.2 81.24,16.78 81.24,18.61 81.39,18.77 82.16,18.77 83.53,20.14 83.53,21.05 86.88,24.4 87.49,24.4 v88.1,25.01 | v87.95,27.45 v86.73,28.67
  Bottom 0.152: v77.89,24.1 77.74,23.95 77.89,23.79 80.33,23.79 81.24,24.71 81.7,24.71 82,25.01 82,29.13 81.85,29.28 81.85,30.35 v81.39,30.8 | DCF.5 79.11,8.86 81.24,10.99 v81.24,13.58 81.39,13.74 94.81,13.74 TEST.2 | v86.73,28.67 v85.51,29.89 | v87.95,27.45 87.64,27.15 87.64,25.47 v88.1,25.01
GND  (via drill 0.3, 0.3 pad 0.61, 0.6)
  Top 0.152: S2.2 58.64,38.98 57.62,40.51 48.68,49.14 R23.1 45.43,49.14 R24.1 42.84,49.09 42.23,49.09 41.01,47.87 U9.7 40.86,46.05 40.86,44.22 C3.1 | S2.1 65.49,38.98 S2.2 | v60.41,38.98 S2.2 | R12.1 60.41,30.35 v60.41,33.65 | R12.1 59.65,27.05 R18.1 59.65,24.76 | 51.27,22.73 C21.- 54.83,24.76 59.65,24.76 | 51.27,22.73 C20.- | 59.91,24.76 R19.1 59.65,24.76 | R12.1 64.48,30.09 v66.2,28.82 | v67.93,30.7 69.3,29.33 71.08,29.33 U1.6 73.16,29.43 v73.93,29.59 | U1.42 82.77,28.82 v80.73,28.82 | U6.10 91.4,29.08 v91.4,30.35 | 94.65,40.51 98.26,40.51 98.26,30.35 U6.1 97.24,29.33 98.01,28.82 98.01,21.2 TEST.4 94.96,18.46 94.96,17.55 89.47,12.06 89.47,7.18 DCF.SH3 | 94.65,40.51 91.4,40.51 v91.4,33.65 91.15,33.65 C10.1 84.29,33.7 82.16,33.7 81.24,32.79 80.33,32.79 80.17,32.94 80.17,33.24 U1.50 | 12VDC.2 35.17,9.93 35.33,9.77 JTAG.20 JTAG.18 | JTAG.18 JTAG.16 JTAG.14 JTAG.12 JTAG.10 JTAG.8 JTAG.6 JTAG.4 63.72,9.47 67.07,6.12 73.47,6.12 DCF.SH1 | JTAG.18 46.44,10.79 46.44,14.6 R10.1 46.7,14.35 43.14,17.65 U8.1 v44.92,21.46 | U7.1 43.14,27.55 v44.92,27.55 | v51.27,21.2 51.27,22.73 | R9.1 51.27,16.63 v51.27,17.85 | v76.52,31.72 76.21,32.18 76.21,33.7 | 76.21,33.7 U1.58 | 76.21,33.7 U1.59 75.67,33.78 75.6,33.85 v75.6,35.23 | v77.74,31.72 v77.74,30.35 | C11.1 70.42,19.22 71.95,19.22 73.77,21.05 73.77,21.81 U1.18 73.62,22.88 73.62,24.4 74.08,24.86 76.36,24.86 v77.13,24.1 77.43,23.64 77.13,22.42 U1.25 77.13,21.81 77.13,21.51 75.45,19.83 75.45,19.07 C9.1 | 94.65,40.51 94.65,49.4 94.45,49.65 | 15.32,22.48 15.37,22.43 | 15.32,22.48 | C23.1 7.45,30.35 15.32,22.48 | v16.47,23.74 16.56,23.74 16.57,23.73 15.32,22.48
  Top 0.152: 30.44,55.49 30.19,55.34 28.36,53.51 28.36,52.6 C4.2 28.36,51.38 28.36,48.33 27.29,47.26 | U10.3 25.16,47.72 25.01,47.72 24.85,47.57 24.85,46.81 25.16,46.81 U10.5 25.92,46.81 26.53,46.81 26.99,47.26 27.29,47.26 | 27.29,47.26 29.73,47.26 U10.7 | v72.4,34.31 68.29,34.31 68.14,34.46 68.14,35.99 C13.2 | v81.55,37.66 81.55,38.27 C12.2
  Top 0.7: 12VDC.2 33.49,9.93 33.49,17.39 28.92,21.97 C18.- 29.15,29.82 | 29.15,29.82 C19.- | 29.15,29.82 29.17,29.84 | v40.09,78.1 40.09,71.75 49.49,71.75 49.49,67.43 BAT.- 56.1,59.56 56.1,55.49 30.44,55.49 30.28,55.66 U2.GND 30.19,59.56 | v61.43,78.1 79.46,78.1 KEYBOARD.1 KEYBOARD.4 | KEYBOARD.4 76.67,74.04 | UMP3.9 22.06,75.31 27.39,75.31 UMP3.3 | AUX.4 AUX.1 94.45,49.65 v89.37,55.24 | v76.92,65.65 KEYBOARD.4 | R24.1 43.4,49.04 43.4,49.14 R24.1
  Top 2: 10.76,17.48 10.12,18.16 3.26,18.16 C22.- | 10.76,17.48 20.64,6.96 12VDC.3 34.25,6.81 34.25,9.93 | 34.25,9.93 34.25,10.03 | 34.25,9.93 12VDC.2 | 10.76,17.48 10.83,17.55 v16.47,23.74
  Bottom 0.152: v60.41,33.65 v60.41,38.98 | v66.2,28.82 v67.93,30.7 | 79.21,25.01 80.73,25.01 v80.73,28.82 C6.1 79.11,29.13 v77.74,30.35 | 79.21,25.01 C7.1 | 79.21,25.01 C5.1 v77.13,24.1 | DCF.SH3 88.61,5.71 84.29,5.46 DCF.SH2 82.26,4.69 78.7,5.46 DCF.SH1 76.42,7.49 78.7,11.04 DCF.8 | v91.4,33.65 v91.4,30.35 | v44.92,21.46 44.92,21.81 | 44.92,21.81 v44.92,27.55 | 51.27,20.75 v51.27,17.85 | 51.27,20.75 v51.27,21.2 | v73.93,29.59 75.15,30.35 C8.1 v76.52,31.72 v77.74,31.72 | 44.92,21.81 46.04,21.81 47.1,20.75 51.27,20.75 | v72.4,34.31 72.86,34.77 76.36,34.77 76.67,34.46 | 76.67,34.46 78.35,34.46 v81.55,37.66 | 76.67,34.46 75.91,35.23 v75.6,35.23
  Bottom 0.7: v40.09,78.1 48.22,78.1 48.22,77.59 VFD.5 49.75,78.1 v61.43,78.1 | v89.37,55.24 87.34,55.24 v76.92,65.65 | UMP3.3 28.41,76.47 29.58,75.31 29.58,60.37 30.44,59.51 | 30.44,59.51 30.49,59.46 | U2.GND 30.44,59.51
  Bottom 2: U5.5 13.44,44.58 13.42,44.57 14.19,44.57 18.44,40.32 U5.8 18.54,40.29 16.47,38.22 v16.47,23.74
KBD_CLR  (via drill 0.3)
  Top 0.152: v85.05,25.32 83.22,25.32 U1.35 | v87.49,20.29 v87.49,23.49 | v76.52,16.02 76.21,16.33 62.8,16.33 61.89,17.24 60.67,17.24 59.75,18.16 v59.75,18.46 | v56.1,18.46 55.64,18.77 50.46,18.77 v50.15,18.46 | v45.28,36.75 45.88,37.36 46.19,37.36 46.49,37.66 47.26,37.66 50.3,40.71 50.3,41.93 v49.7,42.54 | v67.22,67.23 73.93,73.93 KEYBOARD.6
  Bottom 0.152: v85.05,25.32 85.66,25.32 v87.49,23.49 | v87.49,20.29 87.19,20.59 85.2,20.59 83.83,19.22 83.83,18.92 80.63,15.72 76.82,15.72 v76.52,16.02 | v56.1,18.46 v59.75,18.46 | v50.15,18.46 45.88,18.46 43.45,20.9 43.45,34.62 45.28,36.44 v45.28,36.75 | v49.7,42.54 50.15,42.08 53.96,42.08 57.16,45.28 62.8,45.28 67.53,50.01 67.53,66.92 v67.22,67.23
KBD_IRQ  (via drill 0.3)
  Top 0.152: v86.88,32.33 86.88,29.74 86.42,29.28 85.36,29.28 84.9,29.74 84.9,30.04 84.59,30.35 83.22,30.35 U1.45 | v83.38,46.2 v82.46,47.11
  Bottom 0.152: v86.88,32.33 86.88,33.09 86.42,33.55 85.81,33.55 85.66,33.7 85.05,33.7 83.07,35.68 83.07,45.89 v83.38,46.2 | v70.88,55.19 68.14,52.6 68.14,62.2 | 68.14,62.2 68.14,73.32 68.75,73.93 KEYBOARD.10 | 68.14,62.2 69.66,62.2 82.31,49.55 82.31,47.26 v82.46,47.11
KBD_MCLR
  Bottom 0.152: KEYBOARD.9 68.9,76.37 67.83,75.31 67.83,49.86 61.12,43.15 59.75,43.15 S2.4
KBD_SCK  (via drill 0.3)
  Top 0.152: 93.28,24.71 93.28,25.47 93.13,25.62 87.19,25.62 84.75,23.18 81.7,23.18 v81.39,22.88 | 93.28,24.71 93.28,23.79 U6.14 | v78.8,21.2 78.5,21.2 78.19,21.51 78.19,21.81 U1.27 | 93.28,24.71 v93.13,24.71
  Bottom 0.152: v81.39,22.88 80.48,22.88 v78.8,21.2 | KEYBOARD.7 72.25,76.37 73.16,75.46 73.16,73.17 74.99,71.34 75.3,71.34 79.87,66.77 79.87,66.47 80.48,65.86 81.39,65.86 85.97,61.29 95.26,61.29 96.18,60.37 AUX.7 96.33,59.61 95.41,58.69 95.41,51.38 98.77,48.03 98.77,30.65 94.5,26.39 94.2,26.39 93.59,25.78 93.59,25.47 93.13,25.01 v93.13,24.71
KBD_SEL  (via drill 0.3)
  Top 0.152: v85.05,26.39 83.22,26.39 U1.37 | v93.28,27.15 v94.04,27.91 | v88.71,51.23 88.56,56.87 79.87,65.55 v79.57,65.55
  Bottom 0.152: v85.05,26.39 87.03,24.4 92.06,24.4 93.28,25.62 v93.28,27.15 | v94.04,27.91 93.74,27.91 93.59,28.06 90.84,28.06 89.93,28.98 89.32,28.98 88.41,29.89 88.41,35.83 88.71,36.14 v88.71,51.23 | v79.57,65.55 79.57,66.62 75.15,71.04 74.84,71.04 72.1,73.78 KEYBOARD.8
KBD_SIN  (via drill 0.3)
  Top 0.152: U6.15 93.89,23.79 v93.89,24.86 93.89,25.62 93.59,25.93 87.03,25.93 84.59,23.49 81.39,23.49 81.24,23.64 79.72,23.64 79.72,22.88 U1.30 | v98.77,50.77 99.38,51.38 99.38,54.73 97.09,57.02 AUX.5 96.18,57.17 95.57,56.56 91.15,56.56 81.85,65.86 v81.85,66.16
  Bottom 0.152: v98.77,50.77 99.07,50.47 99.07,30.5 94.65,26.08 94.35,26.08 93.89,25.62 v93.89,24.86 | v81.85,66.16 80.63,66.16 80.17,66.62 80.17,66.92 75.6,71.5 75.6,75.61 KEYBOARD.5
KBD_SOUT  (via drill 0.3)
  Top 0.152: v94.5,21.36 94.5,22.88 U6.16 94.5,23.79 v94.5,25.47 | v79.57,21.2 79.11,21.66 79.11,21.81 U1.29 | v80.78,66.77 80.78,66.47 91,56.26 95.26,56.26 96.18,55.34 AUX.3
  Bottom 0.152: v94.5,21.36 94.35,21.2 v79.57,21.2 | v94.5,25.47 99.38,30.35 99.38,52.14 97.09,54.43 AUX.3 | v80.78,66.77 78.19,69.36 78.19,75.46 77.28,76.37 KEYBOARD.3
MP3_RX  (via drill 0.3)
  Top 0.152: v67.53,23.18 72.4,23.18 73.32,24.1 73.32,24.71 74.08,25.47 76.06,25.47 76.36,25.17 77.13,25.17 77.28,25.01 79.57,25.01 80.17,25.62 80.63,25.62 81.09,25.17 81.09,24.4 81.24,24.25 82.16,24.25 U1.33 | v64.48,26.23 64.33,26.39 64.33,27.91 v63.41,28.82 | v60.36,40.56 60.21,40.71 57.92,40.71 50.46,48.18 v50.46,50.92 | v30.19,77.9 v29.43,78.66
  Bottom 0.152: v67.53,23.18 v64.48,26.23 | v63.41,28.82 63.41,37.51 v60.36,40.56 | v50.46,50.92 50.76,51.23 50.76,69.97 48.02,72.71 37.2,72.71 32.02,77.9 v30.19,77.9 | v29.43,78.66 28.82,79.27 18.15,79.27 16.02,77.13 UMP3.13
MP3_TX  (via drill 0.3)
  Top 0.152: v90.54,30.2 89.17,28.82 89.17,27.76 89.47,27.45 89.47,27.15 89.01,26.69 86.88,26.69 85.66,25.47 85.66,25.17 85.2,24.71 84.9,24.71 84.75,24.86 83.22,24.86 U1.34 | v89.32,49.86 88.1,51.07 88.1,56.87 80.17,64.79 v79.57,64.79 | v30.95,78.66 30.34,79.27 20.74,79.27 18.61,77.13 UMP3.11
  Bottom 0.152: v90.54,30.2 88.71,32.02 88.71,35.68 89.01,35.99 89.01,49.55 v89.32,49.86 | v79.57,64.79 78.96,65.4 78.96,66.77 74.99,70.73 74.69,70.73 72.4,73.02 70.73,73.02 70.57,73.17 70.57,77.9 69.51,78.96 49.7,78.96 46.95,78.86 46.95,78.96 31.25,78.96 v30.95,78.66
N$1
  Top 0.152: R1.2 9.31,63.42 UMP_AU.3 AUX_AU.3
N$2  (via drill 0.3)
  Top 0.152: v47.26,21.36 47.26,17.09 R10.2 | v47.26,36.75 50.91,40.41 50.91,41.32 51.07,41.47 51.07,43.3 S1.1
  Bottom 0.152: v47.26,21.36 v47.26,36.75
N$3
  Top 0.152: R2.2 2.91,62.5 2.91,62.96 3.97,64.03 UMP_AU.1 4.58,66.16 4.58,67.53 AUX_AU.1
N$4
  Top 0.152: LED1.C 62.95,24.71 62.19,24.71 R19.2
N$5
  Top 0.152: R23.2 45.88,46.5 45.88,45.13 S1.3
N$6
  Top 0.152: LED2.C 62.95,26.99 62.19,26.99 R18.2
N$7
  Top 0.152: LED2.A 66,26.99 66,25.78 67.07,25.78 70.73,25.78 U1.13
N$8
  Top 0.152: U1.14 70.73,25.32 68.14,25.32 67.53,24.71 66,24.71 LED1.A
N$9  (via drill 0.3)
  Top 0.152: v58.38,32.63 58.38,30.8 R12.2 | v48.48,42.54 S1.2
  Bottom 0.152: v58.38,32.63 v48.48,42.54
N$10
  Top 0.152: C17.1 7.79,57.63 9.31,57.63 9.46,57.78 9.46,59.46 R1.1 8.55,59.76 8.24,60.07 7.79,60.07 C1.1
N$11
  Top 0.152: C16.2 3.52,57.63 1.99,57.63 1.84,57.78 1.84,59.46 R2.1 2.91,60.07 3.67,60.07 C2.2
N$12  (via drill 0.3)
  Top 0.152: C2.1 4.89,61.9 5.8,61.9 v5.96,61.74 6.57,61.74 C1.2 7.18,63.42 UMP_AU.2 7.02,66.16 7.02,67.53 AUX_AU.2
  Bottom 0.152: v5.96,61.74 11.9,55.8 15.86,55.8 16.93,54.73 16.93,52.14 18,51.07 U5.2
N$13
  Top 0.152: 3.27,48.03 3.21,48.03 | 3.27,48.03 5.96,48.03 10.89,48.06 10.89,49.35 10.97,49.43 10.97,49.63 13.47,52.13 13.44,52.16 U5.1 | C17.2 7.79,55.8 6.71,56 6.66,54.75 6.66,54.29 5.65,53.57 2.47,53.57 2.45,50.16 2.45,48.05 2.47,48.03 3.27,48.03
N$14
  Top 0.152: C16.1 3.52,55.8 1.69,55.8 0.62,54.73 0.62,35.53 3.82,32.33 12.97,32.33 U5.13
N$15
  Top 2: U5.4 18.45,47.57 15.56,50.47 15.56,54.28 15.41,54.43 10.53,54.43 6.11,50.01 X1.1
N$16
  Bottom 2: U5.6 18,44.47 17.39,44.47 15.56,46.55 15.56,54.28 15.41,54.43 11.44,54.43 7.48,50.47 7.48,46.96 5.8,45.28 X1.2
N$17
  Top 2: U5.7 12.97,41.47 7.63,41.47 6.11,39.95 X1.3
N$18
  Top 2: U5.9 12.97,39.19 9.77,39.19 5.8,35.23 X1.4
N$19
  Top 0.152: U1.61 74.69,34.31 74.69,35.99 76.52,37.82 76.52,39.64 77.13,40.25 77.18,40.2 Q1.1 78.19,39.19 79.26,39.19 C12.1 79.87,38.27
N$20
  Top 0.152: U1.62 74.23,34.31 74.23,36.29 73.62,36.9 73.62,39.19 Q1.4 71.64,39.19 71.64,39.04 70.12,39.04 69.96,38.88 69.96,37.36 C13.1
N$21  (via drill 0.3)
  Top 0.152: v94.04,27.15 94.35,26.84 96.33,26.84 96.48,26.99 96.48,28.82 U6.2 | v76.82,51.99 78.65,51.99 80.33,50.47 v80.33,48.48
  Bottom 0.152: v94.04,27.15 93.43,27.76 89.62,27.76 85.81,31.57 85.81,32.63 85.36,33.09 84.75,33.09 82.46,35.38 82.46,46.35 v80.33,48.48 | v76.82,51.99 75.15,53.66 BAT.+
N$22
  Top 0.152: U6.5 94.5,29.59 94.5,31.4 93.58,32.32 Q2.4 94.2,32.33
N$23
  Top 0.152: U6.3 95.87,29.59 95.87,31.72 Q2.1
N$24
  Top 0.152: U10.9 29.73,48.33 29.43,48.33 29.27,48.48 29.27,49.09 30.34,50.16 35.22,50.16 37.05,48.33 37.05,47.87 U9.4
N$25
  Top 0.152: U10.10 30.49,48.79 32.17,48.79 33.24,49.86 34.45,49.86 35.67,48.64 35.67,47.87 U9.3
N$26  (via drill 0.3)
  Top 0.152: v80.17,19.98 80.17,21.81 U1.31 | v80.17,18.31 76.06,14.19 74.23,14.19 R17.2
  Bottom 0.152: v80.17,18.31 v80.17,19.98
N$27
  Top 0.152: U1.55 77.74,34.31 77.74,36.29 78.04,36.6 79.87,36.6 80.33,37.05 86.27,37.05 86.27,38.12 R20.2
N$28
  Top 0.152: U6.11 91.3,22.88 91.3,19.38 R21.1
N$29
  Top 0.152: R24.2 43.45,46.5 43.45,45.13 S1.4
OPT1  (via drill 0.3)
  Top 0.152: v68.9,24.25 70.73,24.25 U1.16 | v68.9,27.61 68.9,27.91 61.73,35.07 59.3,35.07 57.92,33.7 45.88,33.7 | 45.88,33.7 45.88,34.31 S1.6 | 45.88,33.7 45.88,33.4 37.5,33.4 37.35,33.55 37.35,35.07 R22.1
  Bottom 0.152: v68.9,27.61 v68.9,24.25
OPT2  (via drill 0.3)
  Top 0.152: v68.14,24.1 68.75,23.49 72.25,23.49 73.01,24.25 73.01,25.93 72.55,26.39 71.79,26.39 U1.12 | v68.14,27.61 68.14,28.21 61.58,34.77 59.45,34.77 58.08,33.4 46.65,33.4 v46.34,33.09 41.92,33.09 41.47,32.63 32.32,32.63 31.1,33.85 R14.1 | v44.36,34.01 44.06,33.7 43.45,33.7 43.45,34.31 S1.5 43.45,36.14
  Bottom 0.152: v68.14,27.61 v68.14,24.1 | v46.34,33.09 45.28,33.09 v44.36,34.01
RST  (via drill 0.3)
  Top 0.152: v76.67,35.99 76.67,34.31 U1.57 | v67.83,41.47 R16.2 67.22,43.61 66.31,43.61 S2.3
  Bottom 0.152: v76.67,35.99 71.79,35.99 71.03,35.23 | 71.03,35.23 67.83,38.43 v67.83,41.47 | 71.03,35.23 48.48,12.67 JTAG.15
RTC_IRQ  (via drill 0.3)
  Top 0.152: v90.54,30.96 93.13,30.96 93.28,30.8 93.28,29.59 U6.7 | v66.61,45.44 67.83,46.66 67.83,50.31 73.62,56.1 84.14,56.1 85.97,54.28 85.97,52.45 89.47,48.94 89.47,46.96 v89.62,46.81 | v67.53,33.85 67.83,33.85 67.98,33.7 70.73,33.7 72.1,32.33 72.1,31.26 72.4,30.96 72.4,30.8 71.79,30.8 U1.3
  Bottom 0.152: v90.54,30.96 90.23,30.96 89.01,32.18 89.01,35.53 89.32,35.83 89.32,46.5 v89.62,46.81 | v66.61,45.44 66.92,45.13 66.92,41.17 67.22,40.86 67.22,38.27 66.15,37.21 66.15,34.92 65.85,34.62 65.85,34.31 66.31,33.85 v67.53,33.85
RTC_SEL  (via drill 0.3)
  Top 0.152: v91.91,25.01 91.91,23.79 U6.12 | v73.62,31.41 72.71,29.74 71.79,29.74 U1.5
  Bottom 0.152: v91.91,25.01 81.39,35.53 79.87,35.53 78.5,34.16 75.76,34.16 73.77,32.18 v73.62,31.41
RTCK  (via drill 0.3)
  Top 0.152: v52.13,34.31 51.52,34.31 S1.8 | v48.48,13.43 49.24,12.67 49.24,11.15 49.39,10.99 51.68,10.99 52.59,11.91 JTAG.11 | v76.36,23.95 76.67,22.88 U1.24 | v67.98,20.59 67.98,21.05 67.37,21.66 55.79,21.66 v55.49,21.36
  Bottom 0.152: v52.13,34.31 52.13,24.71 54.12,22.73 54.42,22.73 55.49,21.66 v55.49,21.36 55.49,20.14 48.93,13.58 48.63,13.58 v48.48,13.43 | v76.36,23.95 76.06,23.49 70.57,23.49 67.98,20.9 v67.98,20.59
SER_RX  (via drill 0.3)
  Top 0.152: v87.34,25.01 87.03,25.01 84.9,22.88 83.98,22.88 78.35,17.24 77.43,17.24 77.13,16.94 74.99,16.94 73.93,18 73.93,20.29 75.15,21.51 75.15,21.81 U1.21 | v86.27,29.89 v86.27,32.94
  Bottom 0.152: v87.34,25.01 87.34,28.82 v86.27,29.89 | v86.27,32.94 85.97,32.94 85.51,33.4 84.9,33.4 82.77,35.53 82.77,46.5 93.59,57.32 AUX.6
SER_TX  (via drill 0.3)
  Top 0.152: v74.23,24.25 74.23,22.88 U1.19 | v66.92,18.46 67.22,18.46 69.05,16.63 v77.58,16.63 | v82,18.16 83.83,19.98 83.83,20.9 87.03,24.1 87.95,24.1 v88.86,25.01 | v88.86,27.3 88.86,31.57 v87.49,32.94 | v95.41,60.37 95.41,61.29 AUX.9
  Bottom 0.152: v74.23,24.25 74.08,24.1 70.73,24.1 66.76,20.14 66.76,19.38 66.92,19.22 v66.92,18.46 | v82,18.16 81.24,18.16 79.87,16.78 77.74,16.78 v77.58,16.63 | v88.86,25.01 v88.86,27.3 | v87.49,32.94 86.58,33.85 85.97,33.85 85.81,34.01 85.2,34.01 83.38,35.83 83.38,45.44 83.98,46.05 83.98,47.26 92.98,56.26 94.35,56.26 95.11,57.02 95.11,58.85 95.41,59.15 v95.41,60.37
TCK  (via drill 0.3)
  Top 0.152: v72.4,28.21 77.13,28.21 77.89,28.98 77.89,29.28 77.13,30.04 77.13,33.24 U1.56 | R9.2 52.13,14.65 52.59,14.65 52.59,14.19 54.12,12.67 55.03,12.67 JTAG.9
  Bottom 0.152: v72.4,28.21 67.83,28.21 67.37,28.06 67.37,27.3 64.48,27.3 55.18,18.46 55.18,12.82 JTAG.9
TDI  (via drill 0.3)
  Top 0.152: v73.77,30.5 75.6,31.87 75.6,32.48 75.15,32.94 75.15,33.24 U1.60 | R6.1 57.16,14.65 57.62,14.65 57.62,14.19 59.3,12.52 60.06,12.52 JTAG.5
  Bottom 0.152: v73.77,30.5 73.16,29.43 73.16,28.67 73.32,28.52 73.32,27.61 74.43,27.45 74.43,26.54 73.32,26.23 72.4,26.23 60.36,14.19 60.36,12.82 JTAG.5
TDO  (via drill 0.3)
  Top 0.152: v73.16,32.02 73.16,33.24 U1.64 | R8.1 49.7,14.04 49.7,13.28 50.15,12.82 JTAG.13
  Bottom 0.152: v73.16,32.02 73.01,32.18 68.44,32.18 50.15,13.89 50.15,12.82 JTAG.13
TEST01  (via drill 0.3)
  Top 0.152: v81.55,32.33 81.39,32.18 80.94,32.18 79.11,30.35 79.11,29.28 75.6,25.78 73.62,25.78 72.86,26.54 v72.86,27.15 | v69.51,26.39 66.76,26.39 v66.76,27.91 | v69.36,30.5 69.81,30.5 69.96,30.35 71.18,30.35 U1.4
  Bottom 0.152: v81.55,32.33 81.55,32.02 82.46,31.11 82.46,29.59 82.61,29.43 82.61,24.71 85.81,21.51 93.89,21.51 94.35,21.97 95.57,21.97 99.38,18.16 99.38,13.74 97.4,11.76 TEST.1 | v72.86,27.15 72.4,27.15 71.49,26.39 v69.51,26.39 | v66.76,27.91 v69.36,30.5
TEST02  (via drill 0.3)
  Top 0.152: v58.53,35.07 58.84,35.38 61.89,35.38 68.9,28.37 70.73,28.37 U1.8 | v60.97,28.37 60.67,28.06 60.67,23.79 61.89,22.58 v70.42,22.58
  Bottom 0.152: v58.53,35.07 58.84,34.77 58.84,33.7 59.75,32.79 59.75,29.59 v60.97,28.37 | 79.57,19.98 79.57,20.14 80.33,20.9 91.3,20.9 95.11,17.09 TEST.3 | 79.57,19.98 79.57,19.83 | 79.57,19.98 74.99,19.98 74.38,20.59 71.95,20.59 v70.42,22.58
TMS  (via drill 0.3)
  Top 0.152: v73.77,26.99 74.08,27.91 77.28,27.91 78.8,29.43 78.8,32.02 79.11,32.33 79.11,33.24 U1.52 | R7.1 54.72,14.04 55.18,14.04 55.94,13.28 56.1,13.28 56.71,12.67 57.62,12.67 JTAG.7
  Bottom 0.152: v73.77,26.99 73.16,26.54 72.25,26.54 58.53,12.82 JTAG.7
TRST  (via drill 0.3)
  Top 0.152: v71.49,17.55 73.62,19.68 73.62,20.44 74.69,21.51 74.69,21.81 U1.20 | R5.1 59.75,14.65 60.67,14.65 62.65,12.67 JTAG.3
  Bottom 0.152: v71.49,17.55 68.59,17.55 63.72,12.67 JTAG.3
VFD_MB  (via drill 0.3)
  Top 0.152: v85.05,27.15 84.75,26.84 84.44,26.84 84.29,26.69 83.98,26.69 83.83,26.84 83.22,26.84 U1.38 | v88.1,22.12 87.8,21.81 87.8,20.75 88.1,20.44 88.1,20.14 87.64,19.68 86.27,19.68 85.2,18.61 v85.2,18.31 | v79.26,12.97 78.96,12.67 74.99,12.67 v74.84,12.82 | v44.51,36.75 45.12,37.36 45.43,37.36 45.73,37.66 46.04,37.66 46.34,37.97 47.1,37.97 49.09,39.95 49.09,42.69 v49.7,43.3
  Bottom 0.152: v85.05,27.15 84.14,26.23 84.14,24.56 85.66,23.03 87.19,23.03 v88.1,22.12 | v85.2,18.31 84.59,17.7 83.98,17.7 v79.26,12.97 | v74.84,12.82 68.75,12.82 66.92,10.99 46.8,10.99 46.65,11.15 46.65,17.24 43.14,20.75 43.14,34.77 44.51,36.14 v44.51,36.75 | v49.7,43.3 50.61,43.3 51.07,43.76 51.07,70.12 48.17,73.02 46.04,73.02 45.88,73.17 45.88,75.61 VFD.9
VFD_RES  (via drill 0.3)
  Top 0.152: v66.46,34.46 66.46,31.72 66.76,31.41 67.22,31.41 67.37,31.57 67.83,31.57 68.14,31.26 70.73,31.26 U1.2 | v67.22,47.57 67.22,59 52.44,73.02 48.22,73.02 VFD.8
  Bottom 0.152: v66.46,34.46 66.46,37.05 67.53,38.12 67.53,41.02 67.22,41.32 v67.22,47.57
VFD_SCK  (via drill 0.3)
  Top 0.152: v83.53,32.33 83.53,31.87 83.83,31.57 83.83,31.26 83.22,31.26 U1.47 | v85.97,22.12 84.44,20.59 v84.44,19.07 | v75.91,15.41 63.26,15.41 61.73,16.94 60.52,16.94 57.01,20.44 55.33,20.44 55.03,20.14 v54.27,20.14 | v50,24.71 v50,27.61 | v49.85,35.38 v49.85,37.05 | v49.85,38.58 49.85,38.88 51.22,40.25 51.22,41.17 51.37,41.32 51.37,42.39 v51.68,42.69
  Bottom 0.152: v83.53,32.33 83.53,24.25 85.66,22.12 v85.97,22.12 | v84.44,19.07 80.78,15.41 v75.91,15.41 | v54.27,20.14 53.2,20.14 50,23.34 v50,24.71 | v50,27.61 50,27.91 47.87,30.04 47.87,33.7 49.54,35.38 v49.85,35.38 | v49.85,37.05 v49.85,38.58 | v51.68,42.69 51.68,69.52 55.03,72.87 55.03,73.78 VFD.2
VFD_SIN  (via drill 0.3)
  Top 0.152: v79.11,35.99 78.96,36.14 78.5,36.14 78.19,35.83 78.19,34.31 U1.54 | v80.94,46.66 v80.94,49.09 | v69.36,57.48 65.09,61.59 52.74,73.93 VFD.4
  Bottom 0.152: v79.11,35.99 79.41,35.99 80.94,37.51 v80.94,46.66 | v80.94,49.09 80.63,49.09 79.26,50.47 79.11,51.53 73.16,57.48 v69.36,57.48
VFD_SOUT  (via drill 0.3)
  Top 0.152: v86.12,36.44 85.81,36.75 83.83,36.75 82.77,35.68 80.63,35.68 80.17,35.23 78.65,35.23 78.65,34.31 U1.53 | v83.98,45.28 83.98,46.81 v81.7,49.09 | v70.73,58.24 66.92,61.74 64.94,62.2 54.42,72.71 v54.42,73.02
  Bottom 0.152: v86.12,36.44 83.68,38.88 83.68,44.98 v83.98,45.28 | v81.7,49.09 81.09,49.7 80.88,50.4 79.97,51.32 79.72,51.53 73.01,58.24 v70.73,58.24 | v54.42,73.02 51.22,73.02 50.3,73.93 VFD.6
VFD_SS  (via drill 0.3)
  Top 0.152: v84.14,27.3 83.22,27.3 U1.39 | v86.73,22.12 86.88,21.97 86.88,20.75 v84.44,18.31 | v77.43,14.8 77.13,14.8 v75.76,13.43 | v72.25,17.24 71.95,16.94 69.2,16.94 67.07,19.07 v59.14,19.07 | v49.54,19.07 v56.71,19.07 | v46.04,36.75 46.65,37.36 47.41,37.36 50.61,40.56 50.61,42.54 v50.46,42.69
  Bottom 0.152: v84.14,27.3 83.83,26.99 83.83,24.4 85.51,22.73 86.12,22.73 v86.73,22.12 | v84.44,18.31 84.14,18.31 80.94,15.11 77.74,15.11 v77.43,14.8 | v75.76,13.43 75.76,13.74 v72.25,17.24 | v56.71,19.07 v59.14,19.07 | v49.54,19.07 45.73,19.07 43.75,21.05 43.75,34.46 v46.04,36.75 | v50.46,42.69 51.37,43.61 51.37,70.28 48.48,73.17 48.48,75.46 48.63,75.61 51.07,75.61 VFD.3

### Text on the board
tPlace: DingDong500 v.2 | www.td3.com
tNames: L+ - R+ -